# EAGLE design V5.8-18-09-30 (EAGLE 7.6.0)
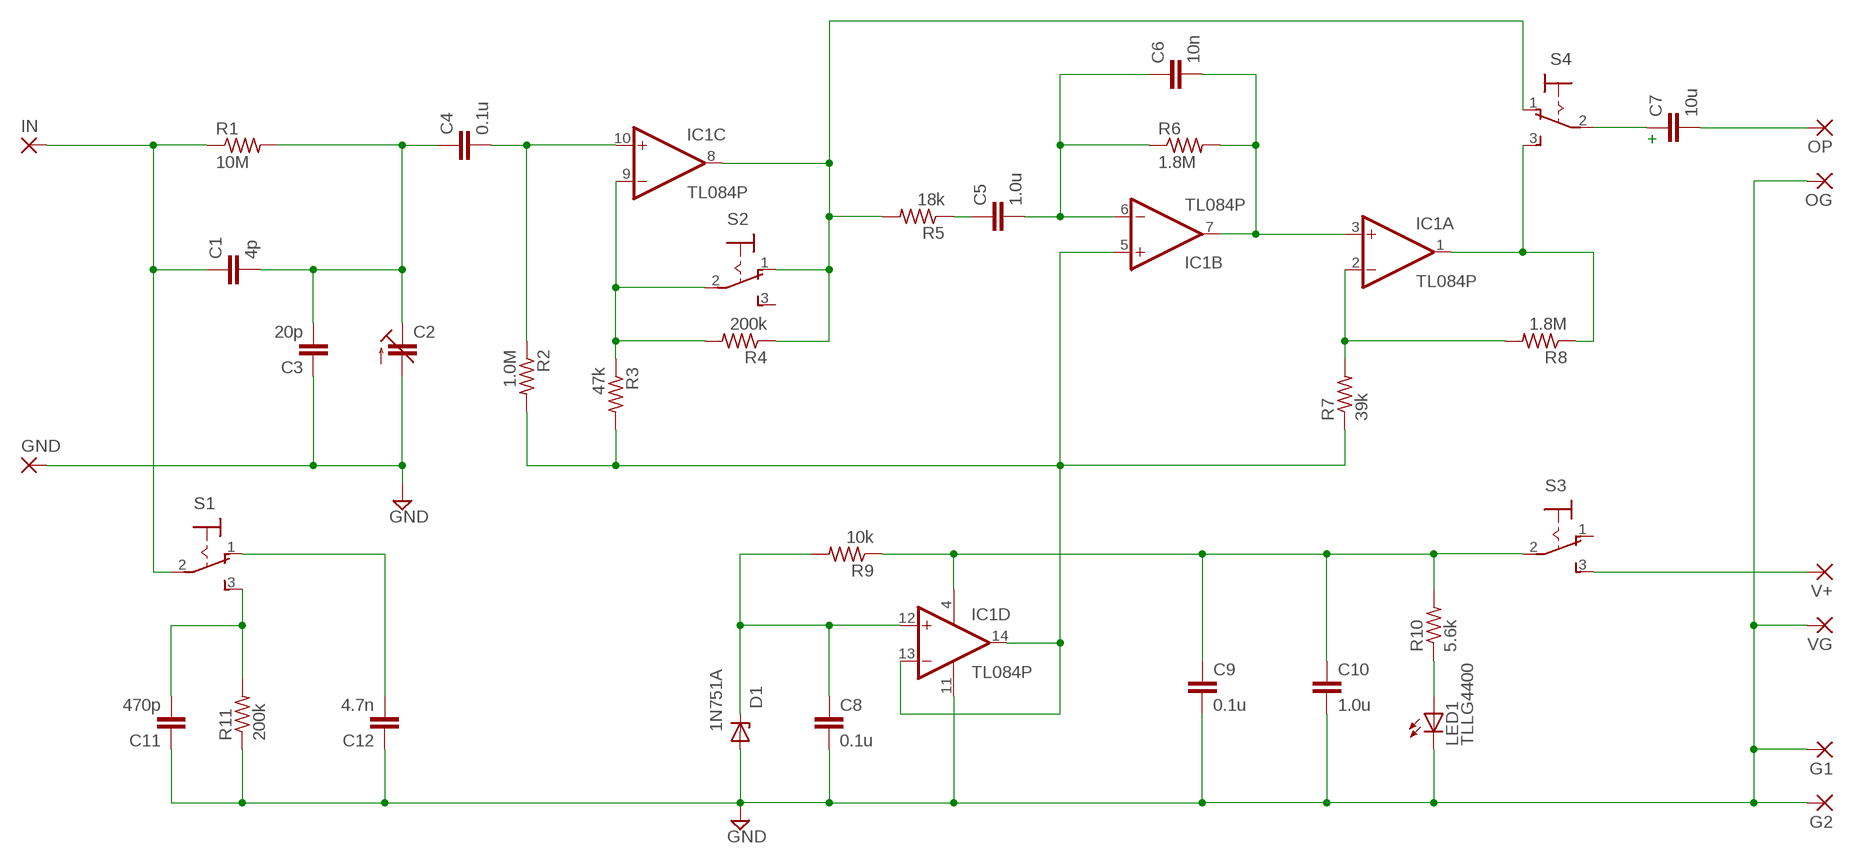
[diagram p0: schematic, sheet 1]

## Parts
C1  4p  C-EU050-024X044  [C050-024X044]
C2  C-TRIMMGKG20015  [GKG20015]
C3  20p  C-EU050-024X044  [C050-024X044]
C4  0.1u  C-EU050-024X044  [C050-024X044]
C5  1.0u  C-EU050-024X044  [C050-024X044]
C6  10n  C-EU050-024X044  [C050-024X044]
C7  10u  C-EU050-024X044  [C050-024X044]
C8  0.1u  C-EU050-024X044  [C050-024X044]
C9  0.1u  C-EU050-024X044  [C050-024X044]
C10  1.0u  C-EU050-024X044  [C050-024X044]
C11  470p  C-EU050-024X044  [C050-024X044]
C12  4.7n  C-EU050-024X044  [C050-024X044]
D1  ZENER-DIODEDO35Z10  [DO35Z10]
G1  2,54/1,1  [2,54/1,1]
G2  2,54/1,1  [2,54/1,1]
GND  2,54/1,1  [2,54/1,1]
IC1  TL084P  [DIL14]
IN  2,54/1,1  [2,54/1,1]
LED1  TLLG4400  [LED3MM]
OG  2,54/1,1  [2,54/1,1]
OP  2,54/1,1  [2,54/1,1]
R1  10M  R-US_0207/10  [0207/10]
R2  1.0M  R-US_0207/10  [0207/10]
R3  47k  R-US_0207/10  [0207/10]
R4  200k  R-US_0207/10  [0207/10]
R5  18k  R-US_0207/10  [0207/10]
R6  1.8M  R-US_0207/10  [0207/10]
R7  39k  R-US_0207/10  [0207/10]
R8  1.8M  R-US_0207/10  [0207/10]
R9  10k  R-US_0207/10  [0207/10]
R10  5.6k  R-US_0207/10  [0207/10]
R11  200k  R-US_0207/10  [0207/10]
S1  320-916  [320-916]
S2  320-916  [320-916]
S3  320-916  [320-916]
S4  320-916  [320-916]
V+  2,54/1,1  [2,54/1,1]
VG  2,54/1,1  [2,54/1,1]

## Nets
GND: C2.1(A) C3.1 C8.2 C9.2 C10.2 C11.1 C12.1 D1.A G1.1(P) G2.1(P) GND.1(P) IC1.11(P:V-) LED1.K(C) OG.1(P) R11.1 VG.1(P)
IT: C12.2 S1.1(O)
N$1: LED1.A R10.1
N$2: C5.1 R5.1
N$3: S3.3(S) V+.1(P)
N$4: IC1.8(C:OUT) R4.1 R5.2 S2.1(O) S4.1(O)
N$5: IC1.9(C:-IN) R3.1 R4.2 S2.2(P)
N$6: C6.2 IC1.3(A:+IN) IC1.7(B:OUT) R6.2
N$7: IC1.2(A:-IN) R7.2 R8.2
N$8: IC1.1(A:OUT) R8.1 S4.3(S)
N$9: C1.2 C2.2(E) C3.2 C4.1 R1.2
N$10: C8.1 D1.C IC1.12(D:+IN) R9.2
N$12: C4.2 IC1.10(C:+IN) R2.1
N$13: C1.1 IN.1(P) R1.1 S1.2(P)
N$14: IC1.5(B:+IN) IC1.13(D:-IN) IC1.14(D:OUT) R2.2 R3.2 R7.1
N$15: C9.1 C10.1 IC1.4(P:V+) R9.1 R10.2 S3.2(P)
N$16: C11.2 R11.2 S1.3(S)
N$17: C7.1 S4.2(P)
N$18: C5.2 C6.1 IC1.6(B:-IN) R6.1
N$22: C7.2 OP.1(P)
Unconnected: S2.3(S) S3.1(O)

## Notes on the sheet
- +

## Library data of the parts
C1 C3-C12 = resistor:C-EU: CAPACITOR, European symbol
C2 = rcl:C-TRIMM: Trimm capacitor
D1 = diode:ZENER-DIODE: Z-Diode
G1 G2 GND IN OG OP V+ VG = wirepad:2,54/1,1: THROUGH-HOLE PAD
IC1 = linear:TL084: OP AMP
LED1 = led:TLLG4400: Low Current (2mA) LED 3 mm Tinted Diffused Package color GREEN Source: Data sheet <http://www.farnell.com/datasheets/391098.pdf>; MF: VISHAY SEMICONDUCTOR; OC_FARNELL: 1612435
R1-R11 = resistor:R-US_: RESISTOR, American symbol
S1-S4 = switch:320-916: TOGGLE SWITCH distributor RS Components

## Board
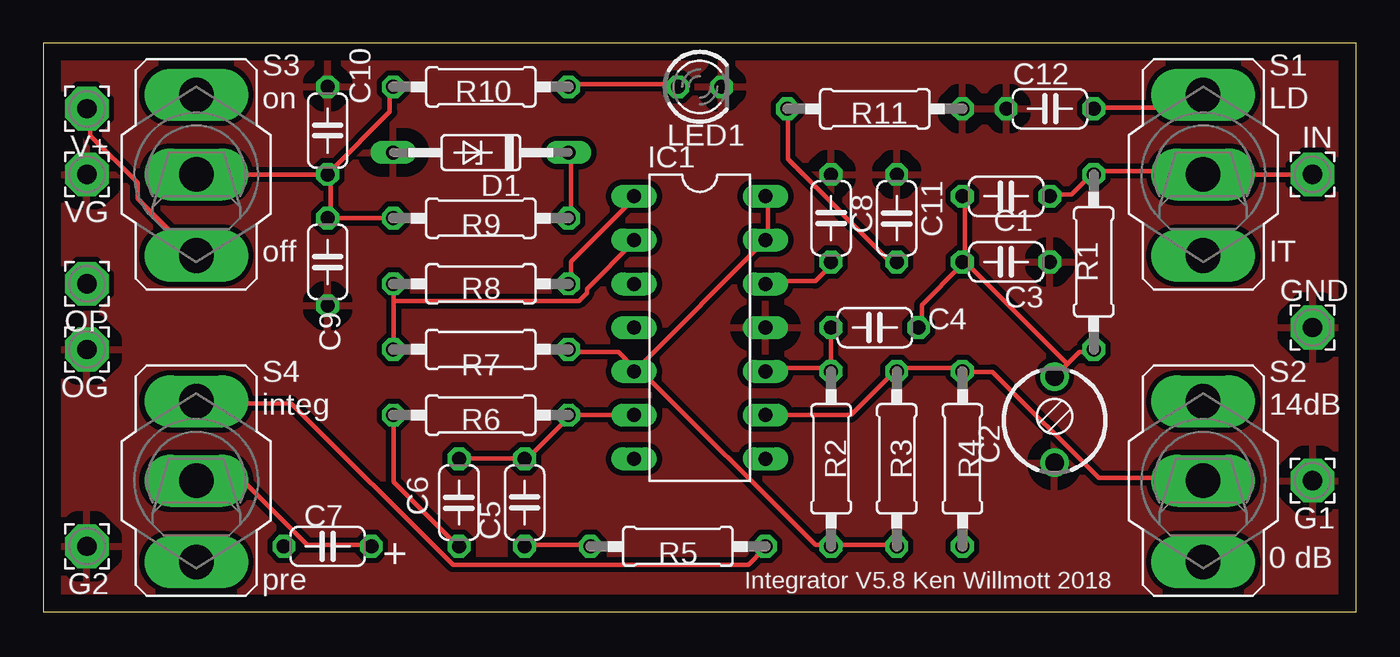
[diagram p1: board, top side]
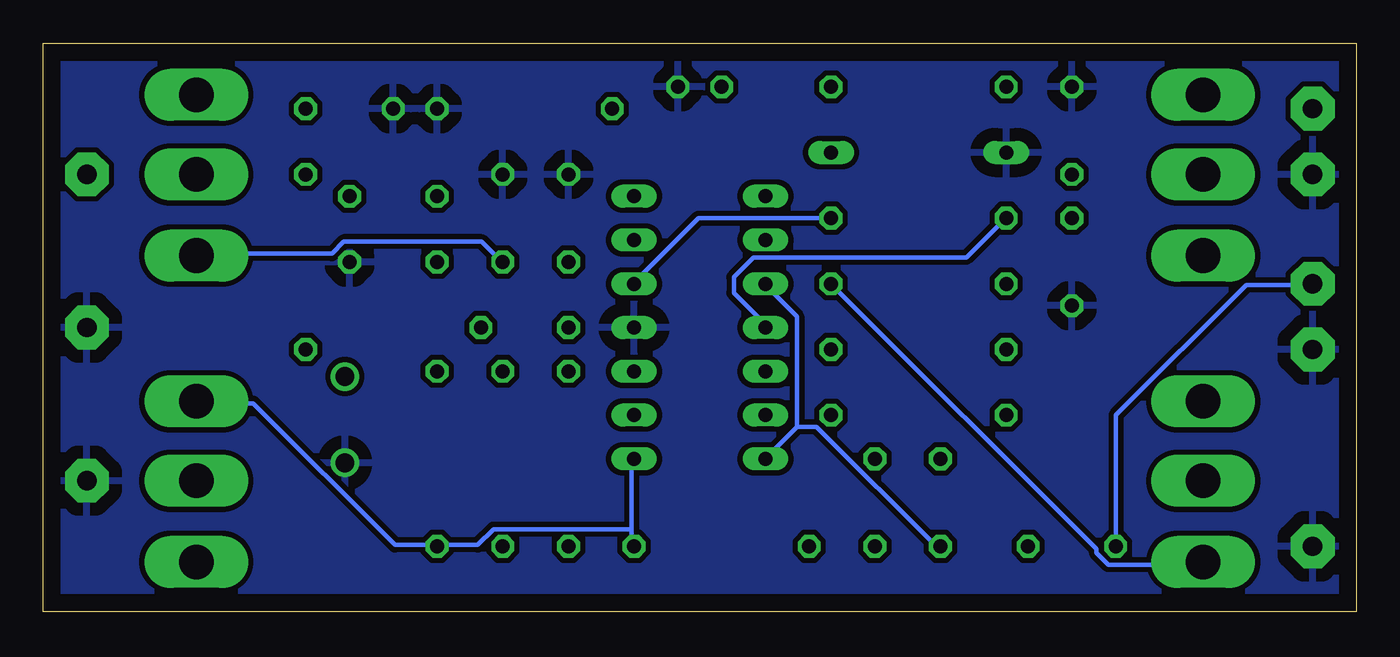
[diagram p2: board, bottom side, seen from below]

Size 76.2 x 33.02 mm. Coordinates in mm from the lower left corner, seen from the top.
Outline: 0,33.02 0,0 76.2,0 76.2,33.02 0,33.02
Copper layers (1*16): Top 0.035mm / dielectric 1.5mm / Bottom 0.035mm
Design rules "default *": minimum track width 10mil, minimum drill 24mil, track to track 8mil, track to pad 8mil, pad to pad 8mil, via to via 8mil, smd to smd 8mil, copper to edge 40mil, drill to drill 8mil, minimum pad ring 10mil, minimum via ring 8mil, stop-mask expansion 4mil, vias tented up to drill 0mil, thermal gap 30mil

### Footprints (pad centres in the part's own frame; a part is rotated, then mirrored left to right if it is on the bottom)
C050-024X044 = drill 0.813 octagon: 1 -2.54,0; 2 2.54,0
GKG20015 = drill 1.1: 1 -2.5,0; 2 2.5,0
DO35Z10 = drill 0.813 long: A 5.08,0; C -5.08,0
2,54/1,1 = drill 1.118 pad 2.54 octagon: 1 0,0
DIL14 = drill 0.813 long: 1 -7.62,-3.81; 2 -5.08,-3.81; 3 -2.54,-3.81; 4 0,-3.81; 5 2.54,-3.81; 6 5.08,-3.81; 7 7.62,-3.81; 8 7.62,3.81; 9 5.08,3.81; 10 2.54,3.81; 11 0,3.81; 12 -2.54,3.81; 13 -5.08,3.81; 14 -7.62,3.81
LED3MM = drill 0.813 octagon: A -1.27,0; K 1.27,0
0207/10 = drill 0.813 octagon: 1 -5.08,0; 2 5.08,0
320-916 = drill 2.007 long: 1 0,4.613; 2 0,0; 3 0,-4.713

### Placement (x,y rotation side)
C1  55.88,24.13 180 top
C2  58.69,11.16 90 top
C3  55.88,20.32 180 top
C4  48.26,16.51 180 top
C5  27.94,6.35 90 top
C6  24.13,6.35 270 top
C7  16.51,3.81 180 top
C8  45.72,22.86 90 top
C9  16.51,20.32 270 top
C10  16.51,27.94 90 top
C11  49.53,22.86 270 top
C12  58.42,29.21 0 top
D1  25.4,26.67 180 top
G1  73.66,7.62 180 top
G2  2.54,3.81 180 top
GND  73.66,16.51 0 top
IC1  38.1,16.51 270 top
IN  73.66,25.4 0 top
LED1  38.1,30.48 0 top
OG  2.54,15.24 180 top
OP  2.54,19.05 180 top
R1  60.96,20.32 270 top
R2  45.72,8.89 270 top
R3  49.53,8.89 270 top
R4  53.34,8.89 90 top
R5  36.83,3.81 0 top
R6  25.4,11.43 180 top
R7  25.4,15.24 180 top
R8  25.4,19.05 180 top
R9  25.4,22.86 0 top
R10  25.4,30.48 180 top
R11  48.26,29.21 180 top
S1  67.31,25.4 0 top
S2  67.31,7.62 0 top
S3  8.89,25.4 0 top
S4  8.89,7.62 0 top
V+  2.54,29.21 180 top
VG  2.54,25.4 180 top

### Tracks (layer width: path | path; a pad name or v marks a point on that pad's centre or on a via)
GND
  pour Bottom (isolate 0.305): 0,0 0,33.02 76.2,33.02 76.2,0
  pour Top (isolate 0.305): 0,0 0,33.02 76.2,33.02 76.2,0
IT
  Top 0.254: C12.2 61.04,29.26 66.52,29.26 67.21,29.95 S1.1
N$1
  Top 0.254: R10.1 30.63,30.63 36.8,30.63 LED1.A
N$2
  Top 0.254: C5.1 28.12,3.89 31.55,3.89 R5.1
N$3
  Top 0.254: V+.1 2.74,29.03 2.74,27.66 5.49,24.92 5.49,24 8.69,20.8 S3.3
N$4
  Top 0.254: S4.1 8.91,12.12 14.4,12.12 23.77,2.74 40.92,2.74 41.83,3.66 R5.2
  Bottom 0.254: 42.06,4.8 42.06,8.69 IC1.8 | 42.06,4.8 42.06,3.89 R5.2 | 42.06,4.8 50.06,4.8 50.98,3.89 53.26,3.89 R4.1 53.49,3.89 55.78,3.89 64.01,12.12 67.21,12.12 S2.1
N$5
  Top 0.254: IC1.9 46.86,11.43 49.38,13.95 R3.1 49.61,14.17 53.26,14.17 R4.2 53.49,13.95 55.09,13.95 61.27,7.77 67.21,7.77 S2.2
N$6
  Top 0.254: R6.2 20.34,11.43 20.34,7.54 24,3.89 C6.2
  Bottom 0.254: 32.46,10.74 34.29,8.91 IC1.7 | 32.46,10.74 32.46,17.14 34.29,18.97 IC1.3 | 32.46,10.74 31.32,10.74 24.23,3.66 C6.2
N$7
  Top 0.254: 20.34,18.06 20.34,18.97 R8.2 | 20.34,18.06 20.34,15.32 R7.2 | 20.34,18.06 31.09,18.06 31.55,18.52 31.55,18.75 34.29,21.49 IC1.2
N$8
  Top 0.254: R8.1 30.63,19.2 30.63,20.34 34.29,24 IC1.1
  Bottom 0.254: R8.1 15.09,3.66 15.09,3.43 14.4,2.74 8.91,2.74 S4.3
N$9
  Top 0.254: 59.44,14.4 58.75,13.72 C2.2 | 59.44,14.4 60.12,15.09 60.81,15.09 R1.2 | C4.1 50.98,16.69 50.98,17.83 53.26,20.12 C3.2 53.49,20.34 | 53.49,20.34 53.49,24 C1.2 | 53.49,20.34 59.44,14.4
N$10
  Top 0.254: R9.2 30.63,22.86 30.63,26.52 D1.C | IC1.12 42.06,19.2 44.81,19.2 45.72,20.12 C8.1
  Bottom 0.254: R9.2 38.18,22.86 41.83,19.2 IC1.12
N$12
  Top 0.254: 45.72,14.17 42.06,14.17 IC1.10 | 45.72,14.17 C4.2 | 45.72,14.17 R2.1
N$13
  Top 0.254: C1.1 58.52,24.23 59.66,24.23 60.81,25.38 R1.1 61.04,25.6 67.21,25.6 S1.2 67.44,25.38 73.61,25.38 IN.1
N$14
  Top 0.254: 45.72,3.89 49.38,3.89 R3.2 | IC1.14 42.06,24 42.06,21.72 IC1.13 41.83,21.49 34.52,14.17 | R7.1 30.63,15.09 33.38,15.09 34.29,14.17 IC1.5 | 34.52,14.17 34.29,13.95 IC1.5 | 45.72,3.89 44.81,3.89 34.52,14.17 | 45.72,3.89 R2.2 | 34.52,14.17 IC1.5
N$15
  Top 0.254: 16.69,22.86 16.69,25.38 C10.1 | 16.69,22.86 R9.1 | 16.69,22.86 C9.1 | R10.2 20.12,30.4 20.12,29.03 16.69,25.6 C10.1 | S3.2 8.91,25.38 16.46,25.38 C10.1
  Bottom 0.254: IC1.4 34.29,16.69 36.12,18.52 36.12,19.43 34.98,20.57 22.63,20.57 20.34,22.86 R9.1
N$16
  Top 0.254: R11.2 43.2,29.03 43.2,26.29 49.38,20.12 C11.2
  Bottom 0.254: S1.3 67.21,20.8 59.44,20.8 58.75,21.49 50.75,21.49 49.61,20.34 C11.2
N$17
  Top 0.254: C7.1 18.97,3.89 15.32,3.89 11.66,7.54 8.91,7.54 S4.2
N$18
  Top 0.254: C6.1 24.23,8.91 27.89,8.91 C5.2 28.12,8.91 30.63,11.43 | IC1.6 30.63,11.43 | 30.63,11.43 R6.1
N$22
  Bottom 0.254: C7.2 13.95,3.89 13.95,11.43 6.4,18.97 2.74,18.97 OP.1

### Text on the board
tNames: on | LD | off | IT | integ | 14dB | + | 0 dB | pre | Integrator V5.8 Ken Willmott 2018